# Altium schematic sheet RF_top.SchDoc
size A
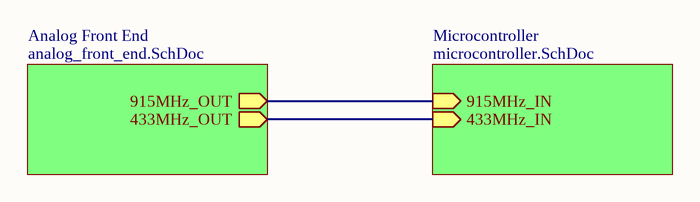
[diagram p0: RF_top.SchDoc]

## Sub-sheets
Analog Front End = analog_front_end.SchDoc: 915MHz_OUT (out), 433MHz_OUT (out)
Microcontroller = microcontroller.SchDoc: 915MHz_IN (in), 433MHz_IN (in)

## Nets
(unnamed): sheet Analog Front End/915MHz_OUT, sheet Microcontroller/915MHz_IN
(unnamed): sheet Analog Front End/433MHz_OUT, sheet Microcontroller/433MHz_IN